# Altium schematic sheet top.SchDoc
size A4; SheetNumber: 1; SheetTotal: 1
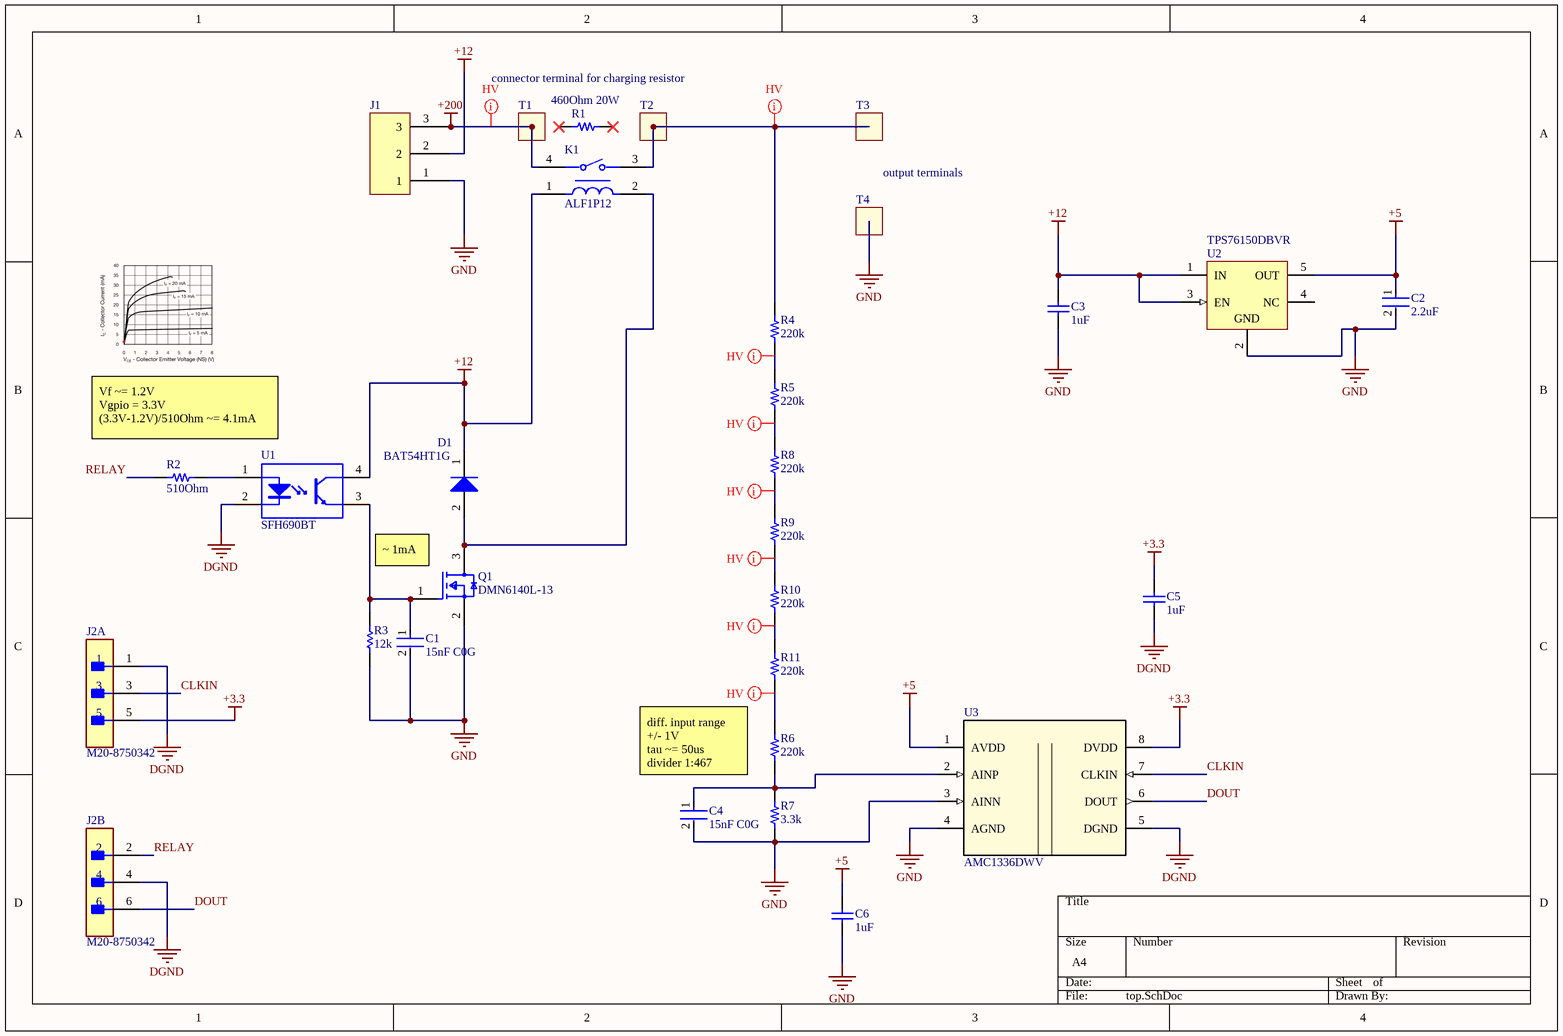
[diagram p0: top.SchDoc]

## Parts
C1  15nF C0G  [FP-C0603C-CF-MFG]
C2  2.2uF  [FP-GRM188-0_1-e0_2_0_5-MFG]
C3  1uF  [CAPC1608X87X35LL15T15]
C4  15nF C0G  [FP-C0603C-CF-MFG]
C5  1uF  [CAPC1608X87X35LL15T15]
C6  1uF  [CAPC1608X87X35LL15T15]
D1  BAT54HT1G  [ONSC-SOD-323-2-477-02_V]
J1  20A Socket 3Pin  [weidmuller_3p_20A]  (value not drawn)
J2  M20-8750342  [FP-M20-8750342-MFG]  (parts A,B of 2)
K1  ALF1P12  [FP-ALF1P12-MFG]
Q1  DMN6140L-13  [FP-SOT23-MFG]
R1  460Ohm 20W
R2  510Ohm  [RES 0603_1608]
R3  12k  [RES 0805_2012]
R4  220k  [RES 0603_1608 RF]
R5  220k  [RES 0603_1608 RF]
R6  220k  [RES 0603_1608 RF]
R7  3.3k  [RES 0603_1608]
R8  220k  [RES 0603_1608 RF]
R9  220k  [RES 0603_1608 RF]
R10  220k  [RES 0603_1608 RF]
R11  220k  [RES 0603_1608 RF]
T1  pwr_connector_quick  [pcb_quick_power_connector]  (value not drawn)
T2  pwr_connector_quick  [pcb_quick_power_connector]  (value not drawn)
T3  pwr_connector_quick  [pcb_quick_power_connector]  (value not drawn)
T4  pwr_connector_quick  [pcb_quick_power_connector]  (value not drawn)
U1  SFH690BT  [VISH-SOP-4_A_V]
U2  TPS76150DBVR  [DBV0005A_M]
U3  AMC1336DWV  [AMC1336]

## Nets
+3.3: C5.2 J2.5 U3.8(DVDD)
+5: C2.1 C6.2 U2.5(OUT) U3.1(AVDD)
+12: C3.2 D1.1(K) J1.2 K1.1 U1.4(COLLECTOR) U2.1(IN) U2.3(EN)
+200: J1.3 K1.4(COM) T1.1
DGND: C5.1 J2.1 J2.4 U1.2(CATHODE) U3.5(DGND)
GND: C1.2 C2.2 C3.1 C4.2 C6.1 J1.1 Q1.2(S) R3.1 R7.1 T4.1 U2.2(GND) U3.3(AINN) U3.4(AGND)
CLKIN: J2.3 U3.7(CLKIN)
DOUT: J2.6 U3.6(DOUT)
RELAY: J2.2 R2.1
NetC1_1: C1.1 Q1.1(G) R3.2 U1.3(EMITTER)
NetC4_1: C4.1 R6.1 R7.2 U3.2(AINP)
NetD1_2: D1.2(A) K1.2 Q1.3(D)
NetK1_3: K1.3(NO) R4.2 T2.1 T3.1
NetR2_2: R2.2 U1.1(ANODE)
NetR4_1: R4.1 R5.2
NetR5_1: R5.1 R8.2
NetR6_2: R6.2 R11.1
NetR8_1: R8.1 R9.2
NetR9_1: R9.1 R10.2
NetR10_1: R10.1 R11.2

Not connected (* = marked no-connect by the designer): R1 1* 2*; U2 4(NC)

## Layout directives
net class HV: +200, NetK1_3, NetR4_1, NetR5_1, NetR6_2, NetR8_1, NetR9_1, NetR10_1

## Notes on the sheet
- connector terminal for charging resistor
- output terminals
- Vf ~= 1.2V
  Vgpio = 3.3V
  (3.3V-1.2V)/510Ohm ~= 4.1mA
- (near Q1) ~ 1mA
- diff. input range +/- 1V
  tau ~= 50us
  divider 1:467

## Library data of the parts
C1 C4 = CMP-03020-015158-1: C0603 15,000 pF C0G 30ppm/°C 20.00% 25 V; Manufacturer Part Number: C0603C153M3GACTU; Manufacturer: KEMET; Material: Ceramic; Tolerance: 0.2; Automotive Grade: Grade 1; Voltage Rating: 25 V; Temperature Coefficient: 30ppm/°C; Lead Free: Yes; Mouser Description: Multilayer Ceramic Capacitors MLCC - SMD/SMT 25volts 0.015uF 20% C0G; Package: C0603C-CF; Height: 0.87mm; Temperature Range Low: -55°C; Temperature Characteristic: C0G; Temperature Range High: +125°C; RoHS: TRUE; ComponentLink2Description: Datasheet; Automotive: Yes; Device Class L3: Ceramic Capacitors; Device Class L2: Capacitors; Octopart: https://octopart.com/c0603c153m3gactu-kemet-104967330; Category: Cap; Device Class L1: Passive Components; ComponentLink2URL: https://api.kemet.com/component-edge/download/datasheet/C0603C100J5GACAUTO.pdf; Capacitance: 15,000 pF; Temperature: -55°C to +125°C; Value: 15,000 pF
C2 = CMP-2006-02836-2: Chip Multilayer Ceramic Capacitors for General Purpose, 0603, 2.2uF, X7R, 15%, 10%, 10V; Case Code (Metric): 1608; Height: 0.8mm; Packaging: Cut Tape; Voltage: 10V; Lead Free: Lead Free; Min Operating Temperature: -55°C; Voltage Rating (DC): 10V; Max Operating Temperature: 125°C; Voltage Rating: 10V; Dielectric: X7R; Depth: 0.8mm; Case Code (Imperial): 0603; Termination: SMD/SMT; Case/Package: 0603; Number of Pins: 2; REACH SVHC: No SVHC; Mount: Surface Mount; Width: 0.031inch; Material: Ceramic; Capacitance: 2.2uF; Package Quantity: 1; Weight: 7.1E-05oz; Length: 1.6mm; Thickness: 0.035inch; Tolerance: 10%
C3 C5 C6 = CMP-2006-03713-1: Part Number: C0603C105K3RACTU; Manufacturer: Kemet
D1 = CMP-1055-00462-1: Schottky Barrier Diode, 2-Pin SOD-323, Pb-Free, Tape and Reel; Manufacturer: On Semiconductor; Configuration: Single; trr Max (ns): 5; IFSM Max (A): 0.6; ComponentLink3URL: http://www.onsemi.com/pub_link/Collateral/477-02.PDF.1; PackageDescription: 2-Pin SOD, Body 1.7 x 1.25 mm; ComponentLink2URL: http://www.onsemi.cn/pub_link/Collateral/BAT54HT1-D.PDF; ComponentLink3Description: Package Specification; ComponentLink2Description: Datasheet; DatasheetVersion: Rev. 6; PackageReference: SOD-323-2-477-02; RoHS: TRUE; ComponentLink1URL: http://www.onsemi.com/; Packing: Tape and Reel; PartNumber: BAT54HT1G; Mounting Technology: Surface Mount; ComponentLink1Description: Manufacturer URL; PackageVersion: Rev. H, 03/2007
J1 = wuerth_connector_straight_30_20A_691311500103: Supplier 1: Rs; Supplier Part Number 1: 1722945
J2 = CMP-15831-000025-1: CONN HEADER SMD 6POS 2.54MM; Connector Type: Male Pin; Current Rating: 3A; Number of Positions: 6; Contact Plating: Gold; Min Operating Temperature: -40°C; Termination: Solder; Insulation Color: Black; Max Operating Temperature: 105°C; Contact Material: Brass; Packaging: Rail/Tube; Contact Shape: Square; Mount: Surface Mount; Insulation Material: Nylon; Fastening Type: Push; Number of Rows: 2; Flammability Rating: UL94 V-0
K1 = CMP-05607-000098-1: RELAY GEN PURPOSE SPST 20A 12V; Number of Poles: 1; Contact Current Rating: 25A; Coil Power: 900mW; Voltage Rating (AC): 250V; Coil Resistance: 160R; Release Time: 15ms; Relay Type: General Purpose; Coil Current: 75mA; Switching Capacity: 6.25kW; Test Voltage: 5kV; Ratings: IP67; Coil Type: Non-Latching; Contact Material: Tin; Min Operating Temperature: -40°C; Throw Configuration: SPST; RoHS Compliant: Yes; Packaging: Box; Package Quantity: 50; Width: 15.7mm; Length: 30.1mm; Depth: 15.7mm; Lead Free: Lead Free; Power Consumption: 900mW; Max Current Rating: 25A; Radiation Hardening: No; Weight: 23g; Termination: PC Pin; Max Operating Temperature: 60°C; Number of Pins: 4; Power Rating: 900mW; Coil Voltage (DC): 12V; Switching Current: 20A; Height: 23.3mm; Mount: Through Hole; Operate Time: 15ms; Max Voltage Rating (AC): 250V
Q1 = CMP-12801-000047-1: MOSFET N-CH 60V 1.6A SOT23; Manufacturer: Diodes Inc.; Turn Off Delay Time: 16.3ns; Power Dissipation: 0.7W; Pulse Drain Current: 10A; Number Of Channels: 1; Reverse Recovery Time: 16.8ns; Typ Forward Diode Voltage: 0.75V; Gate To Source Voltage: 20V; Rthja Max: 183°C/W; Gate Charge At Vgs: 8.6nC @ 10V; Drain To Source Resistance: 92mΩ; Depletion Mode: False; Max Junction Temp: +150°C; Max Forward Diode Voltage: 1V; Reverse Recovery Charge: 9nC; Input Capacitace At Vds: 315pF @ 40V; Standoff Height: 0.013mm; Threshold Vgs Max: 3V; Turn On Delay Time: 2.6ns; Mouser Description: MOSFET 31V to 99V N-Ch FET 60Vds 20Vgs 2.3A; ComponentLink2Description: Datasheet; Digikey Description: MOSFET N-CH 60V 1.6A SOT23; Lead Free: Yes; Category: Trans; Device Class L3: MOSFETs; Temperature Range High: +150°C; Octopart: https://octopart.com/dmn6140l-13-diodes+inc.-38898616; Drain To Source Voltage: 60V; ComponentLink2URL: https://www.diodes.com/assets/Datasheets/DMN6140L.pdf; Drain To Source Breakdown Voltage: 60V; Footprint Url: https://www.diodes.com/assets/Package-Files/SOT23.pdf; Package: SOT23; Continuous Drain Current: 1.6A; Device Class L1: Discrete Semiconductors; Device Class L2: Transistors; Number Of N Channels: 1; Temperature Range Low: -55°C; Height: 1.1mm; Manufacturer Part Number: DMN6140L-13; RoHS: TRUE; Temperature: -55°C to +150°C; Threshold Vgs Min: 1V; Automotive: No
R1 R2 R4-R11 = Resistor: SMT Resistor
  R1: Supplier 1: Digikey; Supplier Part Number 1: A131150-ND
  R4-R6 R8-R11: Supplier 1: Farnell; Supplier Part Number 1: 9238760
R3 = Res1: Resistor; Value: 1K; Published: 8-Jun-2000; LatestRevisionDate: 17-Jul-2002; LatestRevisionNote: Re-released for DXP Platform.; PackageReference: AXIAL-0.3; Publisher: Altium Limited; PackageDescription: Axial Device, Thru-Hole; 2 Leads; 0.3 in Pin Spacing
U1 = CMP-2000-07046-1: Optocoupler Phototransistor Output, 6 V, 50 mA, -55 to 100 degC, 4-Pin SOIC, RoHS, Tape and Reel; Manufacturer: Vishay; Collector Current (DC): 0.1A; Input Type: DC; Collector-Emitter Voltage: 70V; Forward Current: 50mA; Isolation Voltage: 3750V; DELETED: Compliant; Collector-Emitter Saturation Voltage: 0.3V; Power Dissipation: 0.15W; Reverse Breakdown Voltage: 6V; Number of  Elements: 1; Forward Voltage: 1.4V; Rad Hardened: No; Current Transfer Ratio: 300%; Datasheet Version: Rev. 2.6, 11/2015; Manufacturer URL: http://www.vishay.com/; Output Type: DC; Package Reference: SOP-4; Operating Temperature Classification: Industrial; Mounting Technology: SurfaceMount; Mounting: SurfaceMount; Output Device: Transistor; Package Description: 4-Pin Small Outline Package Integrated Circuit, Body 4.575 x 4.42 mm, Pitch 2.54 mm; Package Type: SOP; Operating Temp Range: -55Cto100C; Packaging: TapeandReel; Collector Current (DC) (Max): 0.1A; Pin Count: 4; Datasheet URL: http://www.vishay.com/docs/83686/sfh690ab.pdf
U2 = CMP-0394-00730-2: Single Output LDO, 100 mA, Fixed 5 V Output, 5.38 to 16 V Input, with Low IQ, 5-pin SOT-23 (DBV), -40 to 125 degC, Green (RoHS & no Sb/Br); Manufacturer: Texas Instruments; Fixed Output Options(V): 5; Vin(Max)(V): 16; Iout(Max)(A): 0.1; Vin(Min)(V): 5.38; SubFamily: Single Channel LDO; Accuracy(%): 2; Iq(Typ)(mA): 2.6; Vdo(Typ)(mV): 170; DatasheetVersion: SLVS178B; Mounting Technology: Surface Mount; PartNumber: TPS76150DBVR; PackageDescription: 5-Pin Plastic Small Outline, Body 1.60 Ãƒâ€” 2.90 mm, Pitch 0.95 mm; ComponentLink1URL: http://www.ti.com/; ComponentLink3URL: http://www.ti.com/litv/pdf/mpds018i; Vout Adj(Max)(V): 5; ComponentLink3Description: Package Specification; PackageVersion: 4073253-4/K; ComponentLink2URL: http://www.ti.com/general/docs/lit/getliterature.tsp?genericPartNumber=TPS76150&fileType=pdf; PackageReference: DBV0005A; Vout Adj(Min)(V): 5; ComponentLink1Description: Manufacturer URL; Eco-Plan: Green (RoHS & no Sb/Br); Code_JEDEC: MO-178; ComponentLink2Description: Datasheet
U3 = AMC1336DWV: &plusmn;1-V input, precision voltage sensing reinforced isolated modulator 8-SOIC -40 to 125; Manufacturer_Name: Texas Instruments; TYPE: TYPE; RefDes: RefDes; Copyright: Copyright (C) 2025 Ultra Librarian. All rights reserved.; Manufacturer_Part_Number: AMC1336DWV; Datasheet: https://www.ti.com/lit/gpn/amc1336
T1-T4 = pwr_connector_quick: Supplier 1: Digi-Key; Supplier Part Number 1: WM2984CT-ND